# Altium schematic sheet CPU.SchDoc
size A4
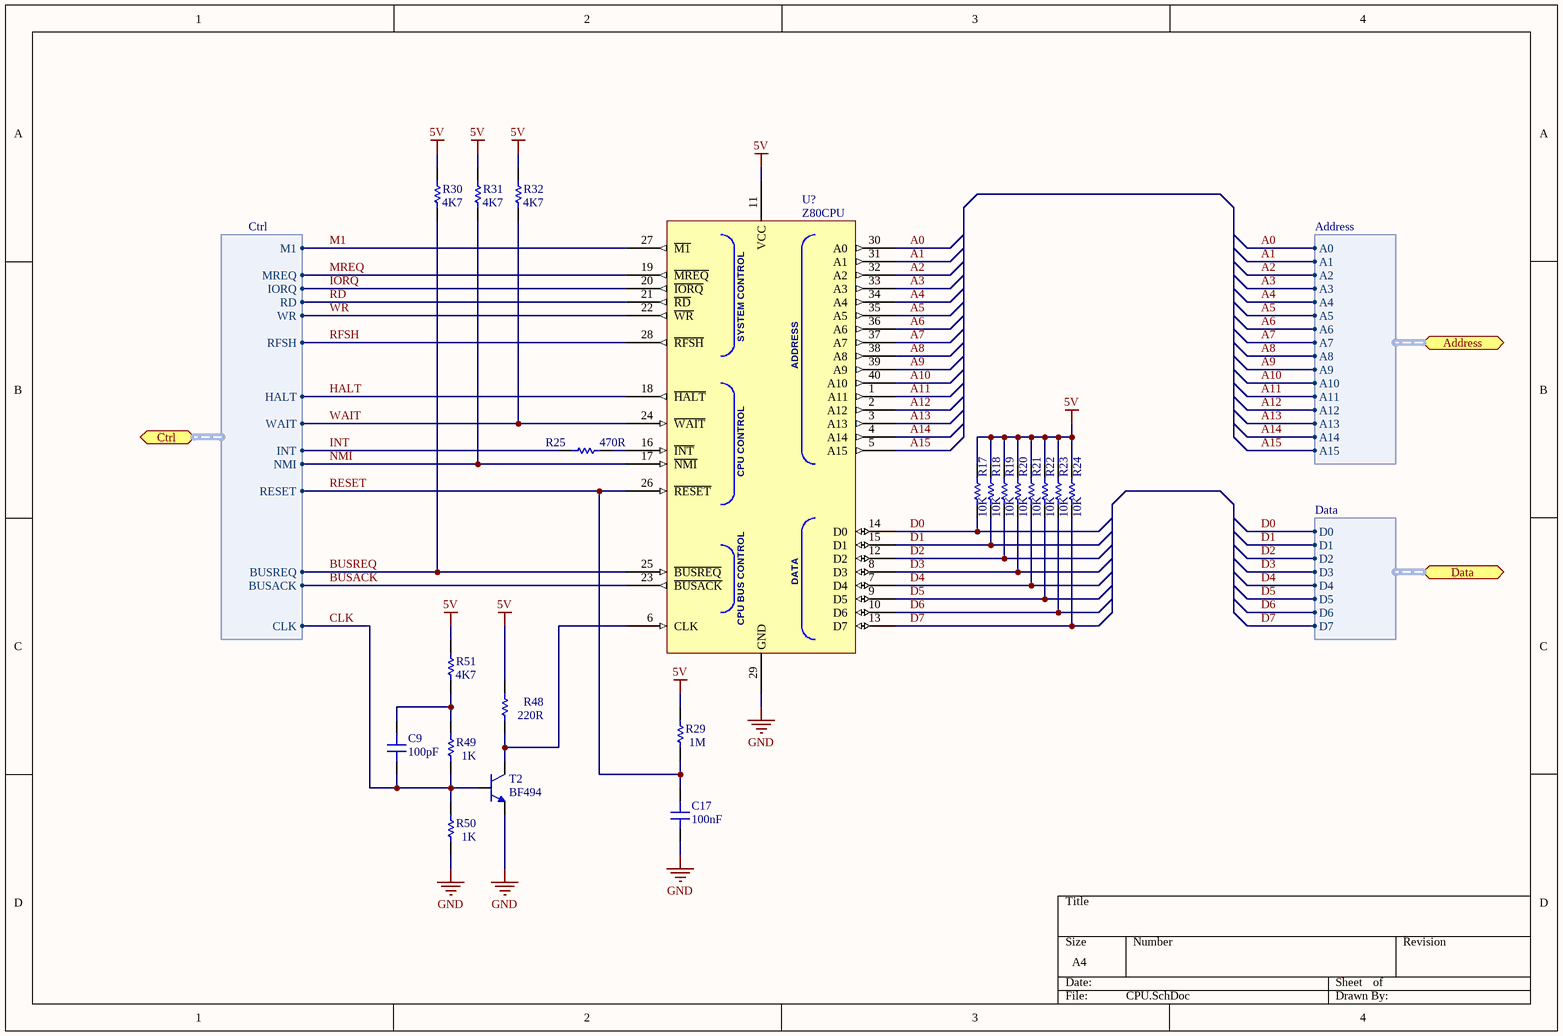
[diagram p0: CPU.SchDoc]

## Parts
C9  100pF  [DiskCapacitor]
C17  100nF  [DiskCapacitor]
R17  10K  [CR25]
R18  10K  [CR25]
R19  10K  [CR25]
R20  10K  [CR25]
R21  10K  [CR25]
R22  10K  [CR25]
R23  10K  [CR25]
R24  10K  [CR25]
R25  470R  [CR25]
R29  1M  [CR25]
R30  4K7  [CR25]
R31  4K7  [CR25]
R32  4K7  [CR25]
R48  220R  [CR25]
R49  1K  [CR25]
R50  1K  [CR25]
R51  4K7  [CR25]
T2  BF494  [TO-92]
U?  Z80CPU  [Z84C00xxPEG]

## Ports
Address (harness Address), Ctrl (harness Ctrl), Data (harness Data)

## Harnesses
Ctrl: M1, MREQ, IORQ, RD, WR, RFSH, HALT, WAIT, INT, NMI, RESET, BUSREQ, BUSACK, CLK
Address: A0, A1, A2, A3, A4, A5, A6, A7, A8, A9, A10, A11, A12, A13, A14, A15
Data: D0, D1, D2, D3, D4, D5, D6, D7

## Nets
5V: R17.2 R18.2 R19.2 R20.2 R21.2 R22.2 R23.2 R24.2 R29.2 R30.2 R31.2 R32.2 R48.2 R51.2 U?.11(VCC)
GND: C17.1 R50.1 T2.2 U?.29(GND)
A0: U?.30(A0) ; port Address.A0
A1: U?.31(A1) ; port Address.A1
A2: U?.32(A2) ; port Address.A2
A3: U?.33(A3) ; port Address.A3
A4: U?.34(A4) ; port Address.A4
A5: U?.35(A5) ; port Address.A5
A6: U?.36(A6) ; port Address.A6
A7: U?.37(A7) ; port Address.A7
A8: U?.38(A8) ; port Address.A8
A9: U?.39(A9) ; port Address.A9
A10: U?.40(A10) ; port Address.A10
A11: U?.1(A11) ; port Address.A11
A12: U?.2(A12) ; port Address.A12
A13: U?.3(A13) ; port Address.A13
A14: U?.4(A14) ; port Address.A14
A15: U?.5(A15) ; port Address.A15
BUSACK: U?.23(~{BUSACK}) ; port Ctrl.BUSACK
BUSREQ: R30.1 U?.25(~{BUSREQ}) ; port Ctrl.BUSREQ
CLK: C9.1 R49.1 R50.2 T2.1 ; port Ctrl.CLK
D0: R17.1 U?.14(D0) ; port Data.D0
D1: R18.1 U?.15(D1) ; port Data.D1
D2: R19.1 U?.12(D2) ; port Data.D2
D3: R20.1 U?.8(D3) ; port Data.D3
D4: R21.1 U?.7(D4) ; port Data.D4
D5: R22.1 U?.9(D5) ; port Data.D5
D6: R23.1 U?.10(D6) ; port Data.D6
D7: R24.1 U?.13(D7) ; port Data.D7
HALT: U?.18(~{HALT}) ; port Ctrl.HALT
INT: R25.1 ; port Ctrl.INT
IORQ: U?.20(~{IORQ}) ; port Ctrl.IORQ
M1: U?.27(~{M1}) ; port Ctrl.M1
MREQ: U?.19(~{MREQ}) ; port Ctrl.MREQ
NMI: R31.1 U?.17(~{NMI}) ; port Ctrl.NMI
RD: U?.21(~{RD}) ; port Ctrl.RD
RESET: C17.2 R29.1 U?.26(~{RESET}) ; port Ctrl.RESET
RFSH: U?.28(~{RFSH}) ; port Ctrl.RFSH
WAIT: R32.1 U?.24(~{WAIT}) ; port Ctrl.WAIT
WR: U?.22(~{WR}) ; port Ctrl.WR
NetC9_2: C9.2 R49.2 R51.1
NetR25_2: R25.2 U?.16(~{INT})
NetR48_1: R48.1 T2.3 U?.6(CLK)

## Notes on the sheet
- (in symbol Z84C00xxPEG) SYSTEM CONTROL; ADDRESS; CPU CONTROL; DATA; CPU BUS CONTROL

## Library data of the parts
C9 C17 = Capacitor
R17-R25 R29-R32 R48-R51 = Resistor
T2 = BF494: NPN Medium Frequency Transistors
U? = Z84C00xxPEG: Z80 - CPU